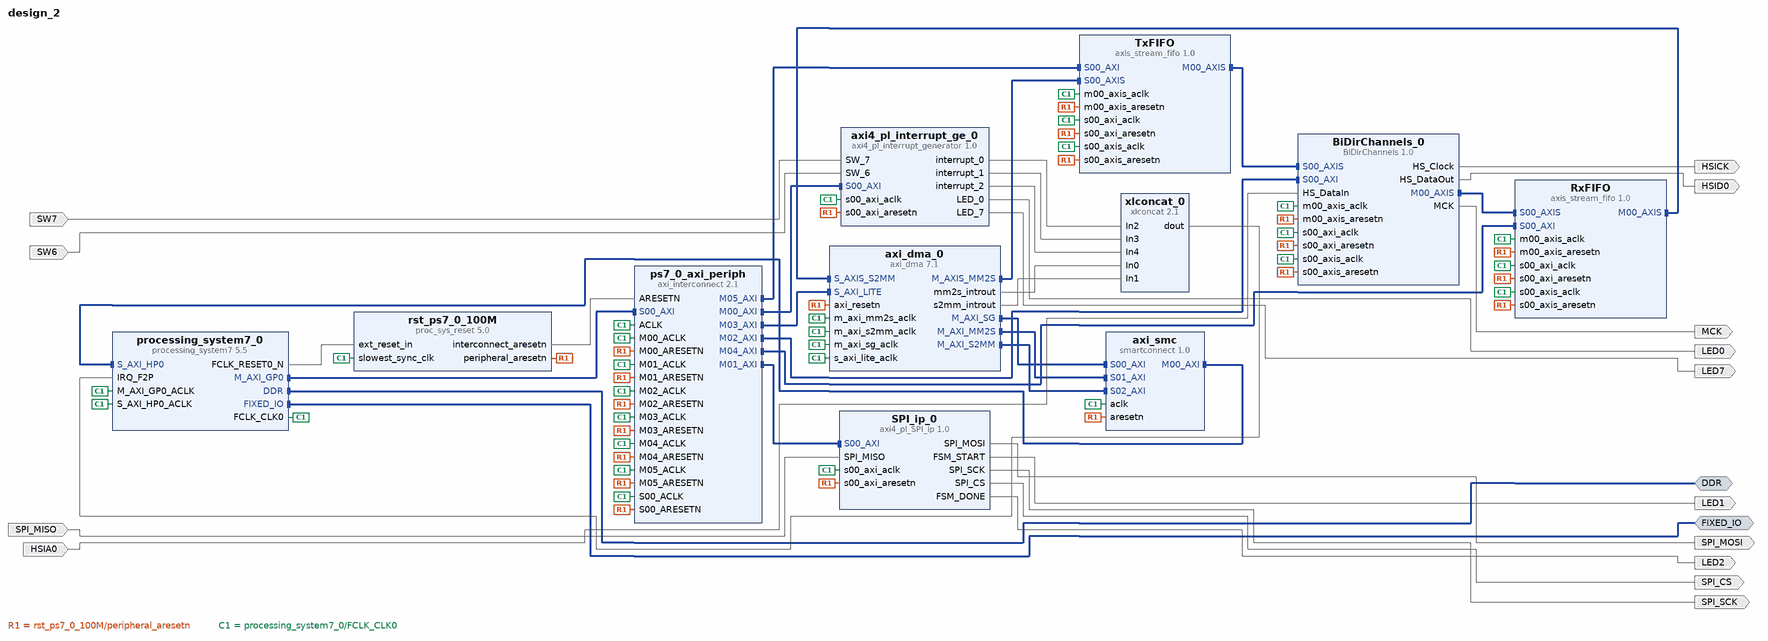
[diagram p0: block diagram of the top level]
# Vivado block design design_2, xc7z020clg484-1, Vivado 2018.2
create_bd_design design_2

create_bd_intf_port -mode Master -vlnv xilinx.com:interface:ddrx_rtl:1.0 DDR
create_bd_intf_port -mode Master -vlnv xilinx.com:display_processing_system7:fixedio_rtl:1.0 FIXED_IO
create_bd_port -dir O -type data LED0
create_bd_port -dir I -type data SW7
create_bd_port -dir O -type data LED7
create_bd_port -dir I -type data SW6
create_bd_port -dir I -type data SPI_MISO
create_bd_port -dir O -type data SPI_MOSI
create_bd_port -dir O -type data SPI_SCK
create_bd_port -dir O -type data SPI_CS
create_bd_port -dir O -type data LED1
create_bd_port -dir O -type data LED2
create_bd_port -dir I -type data HSIA0
create_bd_port -dir O -type data HSICK
create_bd_port -dir O -type data HSID0
create_bd_port -dir O -type data MCK

create_bd_cell -type ip -vlnv xilinx.com:ip:processing_system7:5.5 processing_system7_0
set_property -dict [list \
  CONFIG.PCW_UIPARAM_DDR_FREQ_MHZ 533.333313 \
  CONFIG.PCW_APU_PERIPHERAL_FREQMHZ 666.666667 \
  CONFIG.PCW_SDIO_PERIPHERAL_FREQMHZ 50 \
  CONFIG.PCW_UART_PERIPHERAL_FREQMHZ 50 \
  CONFIG.PCW_FPGA0_PERIPHERAL_FREQMHZ 100.000000 \
  CONFIG.PCW_FPGA1_PERIPHERAL_FREQMHZ 150.000000 \
  CONFIG.PCW_USE_S_AXI_HP0 1 \
  CONFIG.PCW_USE_FABRIC_INTERRUPT 1 \
  CONFIG.PCW_IRQ_F2P_INTR 1 \
  CONFIG.PCW_PERIPHERAL_BOARD_PRESET part0 \
  CONFIG.PCW_PRESET_BANK1_VOLTAGE {LVCMOS 1.8V} \
  CONFIG.PCW_UIPARAM_DDR_PARTNO {MT41J128M16 HA-15E} \
  CONFIG.PCW_QSPI_PERIPHERAL_ENABLE 1 \
  CONFIG.PCW_QSPI_QSPI_IO {MIO 1 .. 6} \
  CONFIG.PCW_QSPI_GRP_SINGLE_SS_ENABLE 1 \
  CONFIG.PCW_QSPI_GRP_SINGLE_SS_IO {MIO 1 .. 6} \
  CONFIG.PCW_SINGLE_QSPI_DATA_MODE x4 \
  CONFIG.PCW_ENET0_PERIPHERAL_ENABLE 1 \
  CONFIG.PCW_ENET0_ENET0_IO {MIO 16 .. 27} \
  CONFIG.PCW_ENET0_GRP_MDIO_ENABLE 1 \
  CONFIG.PCW_ENET0_GRP_MDIO_IO {MIO 52 .. 53} \
  CONFIG.PCW_ENET_RESET_ENABLE 1 \
  CONFIG.PCW_ENET_RESET_SELECT {Share reset pin} \
  CONFIG.PCW_ENET0_RESET_ENABLE 0 \
  CONFIG.PCW_SD0_PERIPHERAL_ENABLE 1 \
  CONFIG.PCW_SD0_SD0_IO {MIO 40 .. 45} \
  CONFIG.PCW_SD0_GRP_CD_ENABLE 1 \
  CONFIG.PCW_SD0_GRP_CD_IO {MIO 47} \
  CONFIG.PCW_SD0_GRP_WP_ENABLE 1 \
  CONFIG.PCW_SD0_GRP_WP_IO {MIO 46} \
  CONFIG.PCW_UART1_PERIPHERAL_ENABLE 1 \
  CONFIG.PCW_UART1_UART1_IO {MIO 48 .. 49} \
  CONFIG.PCW_TTC0_PERIPHERAL_ENABLE 1 \
  CONFIG.PCW_TTC0_TTC0_IO EMIO \
  CONFIG.PCW_USB0_PERIPHERAL_ENABLE 1 \
  CONFIG.PCW_USB0_USB0_IO {MIO 28 .. 39} \
  CONFIG.PCW_USB_RESET_ENABLE 1 \
  CONFIG.PCW_USB_RESET_SELECT {Share reset pin} \
  CONFIG.PCW_USB0_RESET_ENABLE 0 \
  CONFIG.PCW_I2C_RESET_ENABLE 1 \
  CONFIG.PCW_GPIO_MIO_GPIO_ENABLE 1 \
  CONFIG.PCW_GPIO_MIO_GPIO_IO MIO \
  CONFIG.preset ZedBoard \
] [get_bd_cells processing_system7_0]
# 513 more settings of processing_system7_0 are not shown: defaults, MIO pin electricals, DDR timing, and values the tool derives
create_bd_cell -type ip -vlnv xilinx.com:ip:axi_interconnect:2.1 ps7_0_axi_periph
set_property -dict {CONFIG.NUM_MI 6} [get_bd_cells ps7_0_axi_periph]
create_bd_cell -type ip -vlnv xilinx.com:ip:proc_sys_reset:5.0 rst_ps7_0_100M
create_bd_cell -type ip -vlnv xilinx.com:ip:xlconcat:2.1 xlconcat_0
set_property -dict {CONFIG.NUM_PORTS 5} [get_bd_cells xlconcat_0]
create_bd_cell -type ip -vlnv xilinx.com:user:axi4_pl_interrupt_generator:1.0 axi4_pl_interrupt_ge_0
create_bd_cell -type ip -vlnv xilinx.com:user:axi4_pl_SPI_ip:1.0 SPI_ip_0
create_bd_cell -type ip -vlnv xilinx.com:ip:axi_dma:7.1 axi_dma_0
set_property -dict {CONFIG.c_sg_include_stscntrl_strm 0} [get_bd_cells axi_dma_0]
create_bd_cell -type ip -vlnv xilinx.com:ip:smartconnect:1.0 axi_smc
set_property -dict {CONFIG.NUM_SI 3} [get_bd_cells axi_smc]
create_bd_cell -type ip -vlnv xilinx.com:user:axis_stream_fifo:1.0 RxFIFO
set_property -dict {CONFIG.ADDR_WIDTH 12} [get_bd_cells RxFIFO]
create_bd_cell -type ip -vlnv xilinx.com:user:axis_stream_fifo:1.0 TxFIFO
set_property -dict {CONFIG.ADDR_WIDTH 10} [get_bd_cells TxFIFO]
create_bd_cell -type ip -vlnv xilinx.com:user:BiDirChannels:1.0 BiDirChannels_0

# ---- connections ----

connect_bd_intf_net [get_bd_intf_pins processing_system7_0/M_AXI_GP0] [get_bd_intf_pins ps7_0_axi_periph/S00_AXI]
connect_bd_intf_net [get_bd_intf_pins ps7_0_axi_periph/M00_AXI] [get_bd_intf_pins axi4_pl_interrupt_ge_0/S00_AXI]
connect_bd_intf_net [get_bd_intf_pins ps7_0_axi_periph/M01_AXI] [get_bd_intf_pins SPI_ip_0/S00_AXI]
connect_bd_intf_net [get_bd_intf_pins axi_dma_0/M_AXI_SG] [get_bd_intf_pins axi_smc/S00_AXI]
connect_bd_intf_net [get_bd_intf_pins axi_smc/M00_AXI] [get_bd_intf_pins processing_system7_0/S_AXI_HP0]
connect_bd_intf_net [get_bd_intf_pins ps7_0_axi_periph/M03_AXI] [get_bd_intf_pins axi_dma_0/S_AXI_LITE]
connect_bd_intf_net [get_bd_intf_pins axi_dma_0/M_AXI_MM2S] [get_bd_intf_pins axi_smc/S01_AXI]
connect_bd_intf_net [get_bd_intf_pins axi_dma_0/M_AXI_S2MM] [get_bd_intf_pins axi_smc/S02_AXI]
connect_bd_intf_net -intf_net axis_stream_fifo_0_M00_AXIS [get_bd_intf_pins RxFIFO/M00_AXIS] [get_bd_intf_pins axi_dma_0/S_AXIS_S2MM]
connect_bd_intf_net [get_bd_intf_pins ps7_0_axi_periph/M04_AXI] [get_bd_intf_pins RxFIFO/S00_AXI]
connect_bd_intf_net [get_bd_intf_pins axi_dma_0/M_AXIS_MM2S] [get_bd_intf_pins TxFIFO/S00_AXIS]
connect_bd_intf_net [get_bd_intf_pins ps7_0_axi_periph/M05_AXI] [get_bd_intf_pins TxFIFO/S00_AXI]
connect_bd_intf_net [get_bd_intf_pins ps7_0_axi_periph/M02_AXI] [get_bd_intf_pins BiDirChannels_0/S00_AXI]
connect_bd_intf_net [get_bd_intf_pins BiDirChannels_0/M00_AXIS] [get_bd_intf_pins RxFIFO/S00_AXIS]
connect_bd_intf_net [get_bd_intf_pins TxFIFO/M00_AXIS] [get_bd_intf_pins BiDirChannels_0/S00_AXIS]
connect_bd_intf_net [get_bd_intf_ports DDR] [get_bd_intf_pins processing_system7_0/DDR]
connect_bd_intf_net [get_bd_intf_ports FIXED_IO] [get_bd_intf_pins processing_system7_0/FIXED_IO]
connect_bd_net [get_bd_pins processing_system7_0/FCLK_RESET0_N] [get_bd_pins rst_ps7_0_100M/ext_reset_in]
connect_bd_net [get_bd_pins rst_ps7_0_100M/peripheral_aresetn] \
  [get_bd_pins axi4_pl_interrupt_ge_0/s00_axi_aresetn] [get_bd_pins SPI_ip_0/s00_axi_aresetn] [get_bd_pins axi_smc/aresetn] \
  [get_bd_pins axi_dma_0/axi_resetn] [get_bd_pins RxFIFO/s00_axi_aresetn] [get_bd_pins RxFIFO/m00_axis_aresetn] \
  [get_bd_pins RxFIFO/s00_axis_aresetn] [get_bd_pins TxFIFO/s00_axi_aresetn] [get_bd_pins TxFIFO/m00_axis_aresetn] \
  [get_bd_pins TxFIFO/s00_axis_aresetn] [get_bd_pins ps7_0_axi_periph/S00_ARESETN] [get_bd_pins ps7_0_axi_periph/M00_ARESETN] \
  [get_bd_pins ps7_0_axi_periph/M01_ARESETN] [get_bd_pins ps7_0_axi_periph/M02_ARESETN] \
  [get_bd_pins ps7_0_axi_periph/M03_ARESETN] [get_bd_pins ps7_0_axi_periph/M04_ARESETN] \
  [get_bd_pins ps7_0_axi_periph/M05_ARESETN] [get_bd_pins BiDirChannels_0/s00_axi_aresetn] \
  [get_bd_pins BiDirChannels_0/m00_axis_aresetn] [get_bd_pins BiDirChannels_0/s00_axis_aresetn]
connect_bd_net [get_bd_pins rst_ps7_0_100M/interconnect_aresetn] [get_bd_pins ps7_0_axi_periph/ARESETN]
connect_bd_net [get_bd_pins xlconcat_0/dout] [get_bd_pins processing_system7_0/IRQ_F2P]
connect_bd_net [get_bd_pins axi4_pl_interrupt_ge_0/LED_0] [get_bd_ports LED0]
connect_bd_net [get_bd_ports SW7] [get_bd_pins axi4_pl_interrupt_ge_0/SW_7]
connect_bd_net [get_bd_pins axi4_pl_interrupt_ge_0/LED_7] [get_bd_ports LED7]
connect_bd_net -net SW6_1 [get_bd_ports SW6] [get_bd_pins axi4_pl_interrupt_ge_0/SW_6]
connect_bd_net [get_bd_ports SPI_MISO] [get_bd_pins SPI_ip_0/SPI_MISO]
connect_bd_net [get_bd_pins SPI_ip_0/SPI_MOSI] [get_bd_ports SPI_MOSI]
connect_bd_net [get_bd_pins SPI_ip_0/SPI_SCK] [get_bd_ports SPI_SCK]
connect_bd_net [get_bd_pins SPI_ip_0/SPI_CS] [get_bd_ports SPI_CS]
connect_bd_net [get_bd_pins SPI_ip_0/FSM_START] [get_bd_ports LED1]
connect_bd_net [get_bd_pins SPI_ip_0/FSM_DONE] [get_bd_ports LED2]
connect_bd_net [get_bd_pins processing_system7_0/FCLK_CLK0] \
  [get_bd_pins processing_system7_0/M_AXI_GP0_ACLK] [get_bd_pins rst_ps7_0_100M/slowest_sync_clk] \
  [get_bd_pins axi4_pl_interrupt_ge_0/s00_axi_aclk] [get_bd_pins SPI_ip_0/s00_axi_aclk] \
  [get_bd_pins processing_system7_0/S_AXI_HP0_ACLK] [get_bd_pins axi_smc/aclk] [get_bd_pins axi_dma_0/m_axi_sg_aclk] \
  [get_bd_pins axi_dma_0/s_axi_lite_aclk] [get_bd_pins axi_dma_0/m_axi_mm2s_aclk] [get_bd_pins axi_dma_0/m_axi_s2mm_aclk] \
  [get_bd_pins RxFIFO/s00_axi_aclk] [get_bd_pins RxFIFO/m00_axis_aclk] [get_bd_pins RxFIFO/s00_axis_aclk] \
  [get_bd_pins TxFIFO/s00_axi_aclk] [get_bd_pins TxFIFO/m00_axis_aclk] [get_bd_pins TxFIFO/s00_axis_aclk] \
  [get_bd_pins ps7_0_axi_periph/ACLK] [get_bd_pins ps7_0_axi_periph/S00_ACLK] [get_bd_pins ps7_0_axi_periph/M00_ACLK] \
  [get_bd_pins ps7_0_axi_periph/M01_ACLK] [get_bd_pins ps7_0_axi_periph/M02_ACLK] [get_bd_pins ps7_0_axi_periph/M03_ACLK] \
  [get_bd_pins ps7_0_axi_periph/M04_ACLK] [get_bd_pins ps7_0_axi_periph/M05_ACLK] [get_bd_pins BiDirChannels_0/s00_axi_aclk] \
  [get_bd_pins BiDirChannels_0/m00_axis_aclk] [get_bd_pins BiDirChannels_0/s00_axis_aclk]
connect_bd_net [get_bd_pins axi4_pl_interrupt_ge_0/interrupt_0] [get_bd_pins xlconcat_0/In2]
connect_bd_net [get_bd_pins axi4_pl_interrupt_ge_0/interrupt_1] [get_bd_pins xlconcat_0/In3]
connect_bd_net [get_bd_pins axi4_pl_interrupt_ge_0/interrupt_2] [get_bd_pins xlconcat_0/In4]
connect_bd_net [get_bd_pins axi_dma_0/mm2s_introut] [get_bd_pins xlconcat_0/In0]
connect_bd_net [get_bd_pins axi_dma_0/s2mm_introut] [get_bd_pins xlconcat_0/In1]
connect_bd_net -net HSIA0_1 [get_bd_ports HSIA0] [get_bd_pins BiDirChannels_0/HS_DataIn]
connect_bd_net [get_bd_pins BiDirChannels_0/HS_Clock] [get_bd_ports HSICK]
connect_bd_net [get_bd_pins BiDirChannels_0/HS_DataOut] [get_bd_ports HSID0]
connect_bd_net [get_bd_pins BiDirChannels_0/MCK] [get_bd_ports MCK]

# ---- address map ----
assign_bd_address -offset 0x00000000 -range 512M -target_address_space [get_bd_addr_spaces axi_dma_0/Data_MM2S] [get_bd_addr_segs processing_system7_0/S_AXI_HP0/HP0_DDR_LOWOCM]
assign_bd_address -offset 0x00000000 -range 512M -target_address_space [get_bd_addr_spaces axi_dma_0/Data_S2MM] [get_bd_addr_segs processing_system7_0/S_AXI_HP0/HP0_DDR_LOWOCM]
assign_bd_address -offset 0x00000000 -range 512M -target_address_space [get_bd_addr_spaces axi_dma_0/Data_SG] [get_bd_addr_segs processing_system7_0/S_AXI_HP0/HP0_DDR_LOWOCM]
assign_bd_address -offset 0x40400000 -range 64K -target_address_space [get_bd_addr_spaces processing_system7_0/Data] [get_bd_addr_segs axi_dma_0/S_AXI_LITE/Reg]
assign_bd_address -offset 0x43C00000 -range 64K -target_address_space [get_bd_addr_spaces processing_system7_0/Data] [get_bd_addr_segs axi4_pl_interrupt_ge_0/S00_AXI/S00_AXI_reg]
assign_bd_address -offset 0x43C10000 -range 64K -target_address_space [get_bd_addr_spaces processing_system7_0/Data] [get_bd_addr_segs SPI_ip_0/S00_AXI/S00_AXI_reg]
assign_bd_address -offset 0x43C20000 -range 64K -target_address_space [get_bd_addr_spaces processing_system7_0/Data] [get_bd_addr_segs BiDirChannels_0/S00_AXI/S00_AXI_reg]
assign_bd_address -offset 0x43C30000 -range 64K -target_address_space [get_bd_addr_spaces processing_system7_0/Data] [get_bd_addr_segs RxFIFO/S00_AXI/S00_AXI_reg]
assign_bd_address -offset 0x43C40000 -range 64K -target_address_space [get_bd_addr_spaces processing_system7_0/Data] [get_bd_addr_segs TxFIFO/S00_AXI/S00_AXI_reg]

validate_bd_design
save_bd_design
